# EAGLE schematic untitled (EAGLE 8.0.2)
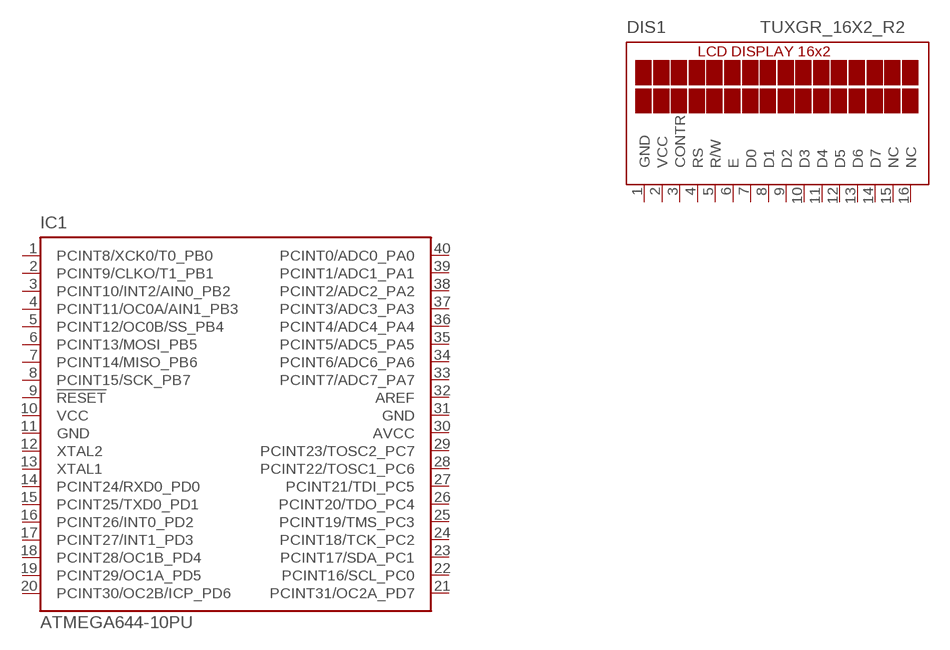
[diagram p0: schematic, sheet 1]

## Parts
DIS1  TUXGR_16X2_R2  [TUXGR_16X2_R2]
IC1  ATMEGA644-10PU  [DIL40]
Unconnected: DIS1.3(CONTR) DIS1.4(RS) DIS1.5(R/W) DIS1.6(E) DIS1.7(D0) DIS1.8(D1) DIS1.9(D2) DIS1.10(D3) DIS1.11(D4) DIS1.12(D5) DIS1.13(D6) DIS1.14(D7) DIS1.15(NC) DIS1.16(NC) IC1.1(PCINT8/XCK0/T0_PB0) IC1.2(PCINT9/CLKO/T1_PB1) IC1.3(PCINT10/INT2/AIN0_PB2) IC1.4(PCINT11/OC0A/AIN1_PB3) IC1.5(PCINT12/OC0B/SS_PB4) IC1.6(PCINT13/MOSI_PB5) IC1.7(PCINT14/MISO_PB6) IC1.8(PCINT15/SCK_PB7) IC1.9(!RESET) IC1.12(XTAL2) IC1.13(XTAL1) IC1.14(PCINT24/RXD0_PD0) IC1.15(PCINT25/TXD0_PD1) IC1.16(PCINT26/INT0_PD2) IC1.17(PCINT27/INT1_PD3) IC1.18(PCINT28/OC1B_PD4) IC1.19(PCINT29/OC1A_PD5) IC1.20(PCINT30/OC2B/ICP_PD6) IC1.21(PCINT31/OC2A_PD7) IC1.22(PCINT16/SCL_PC0) IC1.23(PCINT17/SDA_PC1) IC1.24(PCINT18/TCK_PC2) IC1.25(PCINT19/TMS_PC3) IC1.26(PCINT20/TDO_PC4) IC1.27(PCINT21/TDI_PC5) IC1.28(PCINT22/TOSC1_PC6) IC1.29(PCINT23/TOSC2_PC7) IC1.32(AREF) IC1.33(PCINT7/ADC7_PA7) IC1.34(PCINT6/ADC6_PA6) IC1.35(PCINT5/ADC5_PA5) IC1.36(PCINT4/ADC4_PA4) IC1.37(PCINT3/ADC3_PA3) IC1.38(PCINT2/ADC2_PA2) IC1.39(PCINT1/ADC1_PA1) IC1.40(PCINT0/ADC0_PA0)

## Power pins joined to a net without a drawn wire
AVCC: IC1.30(AVCC)
GND: DIS1.1(GND) IC1.11(GND) IC1.31(GND)
VCC: DIS1.2(VCC) IC1.10(VCC)

## Library data of the parts
DIS1 = display-lcd:TUXGR_16X2_R2: Tuxgraphics LCD display 16x2 characters reflective, without background light Source: tuxgr_12x2_r2.pdf; OC_FARNELL: unknown; OC_NEWARK: unknown
IC1 = atmel:ATMEGA644-*PU: 8-bit Microcontroller with 64K Bytes In-System Programmable Flash Auto generated by make-symbol-device-package-bsdl.ulp Rev. 34 Source: http://www.atmel.com/dyn/resources/prod_documents/doc2593.pdf; MPN: ATMEGA644V-10PU; OC_FARNELL: 1288342; OC_NEWARK: 23M5062